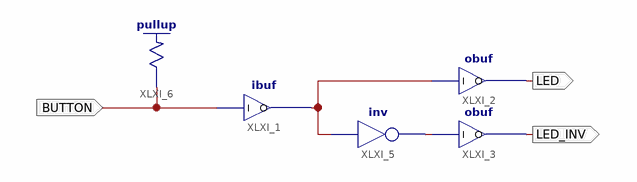
[diagram p0: schematic sheet 1]
// Xilinx ISE schematic CPLDIntro3LEDinverse.sch (xbr) as structural Verilog: 5 symbols, 3 ports
module CPLDIntro3LEDinverse (
  input  BUTTON,
  output LED,
  output LED_INV
);

  wire XLXN_3, XLXN_5;

  ibuf XLXI_1 (.I(BUTTON), .O(XLXN_5));
  obuf XLXI_2 (.I(XLXN_5), .O(LED));
  obuf XLXI_3 (.I(XLXN_3), .O(LED_INV));
  not XLXI_5 (XLXN_3, XLXN_5);
  \pullup  XLXI_6 (.O(BUTTON));
endmodule
